# Altium project Gas_Analyzer.PrjPcb
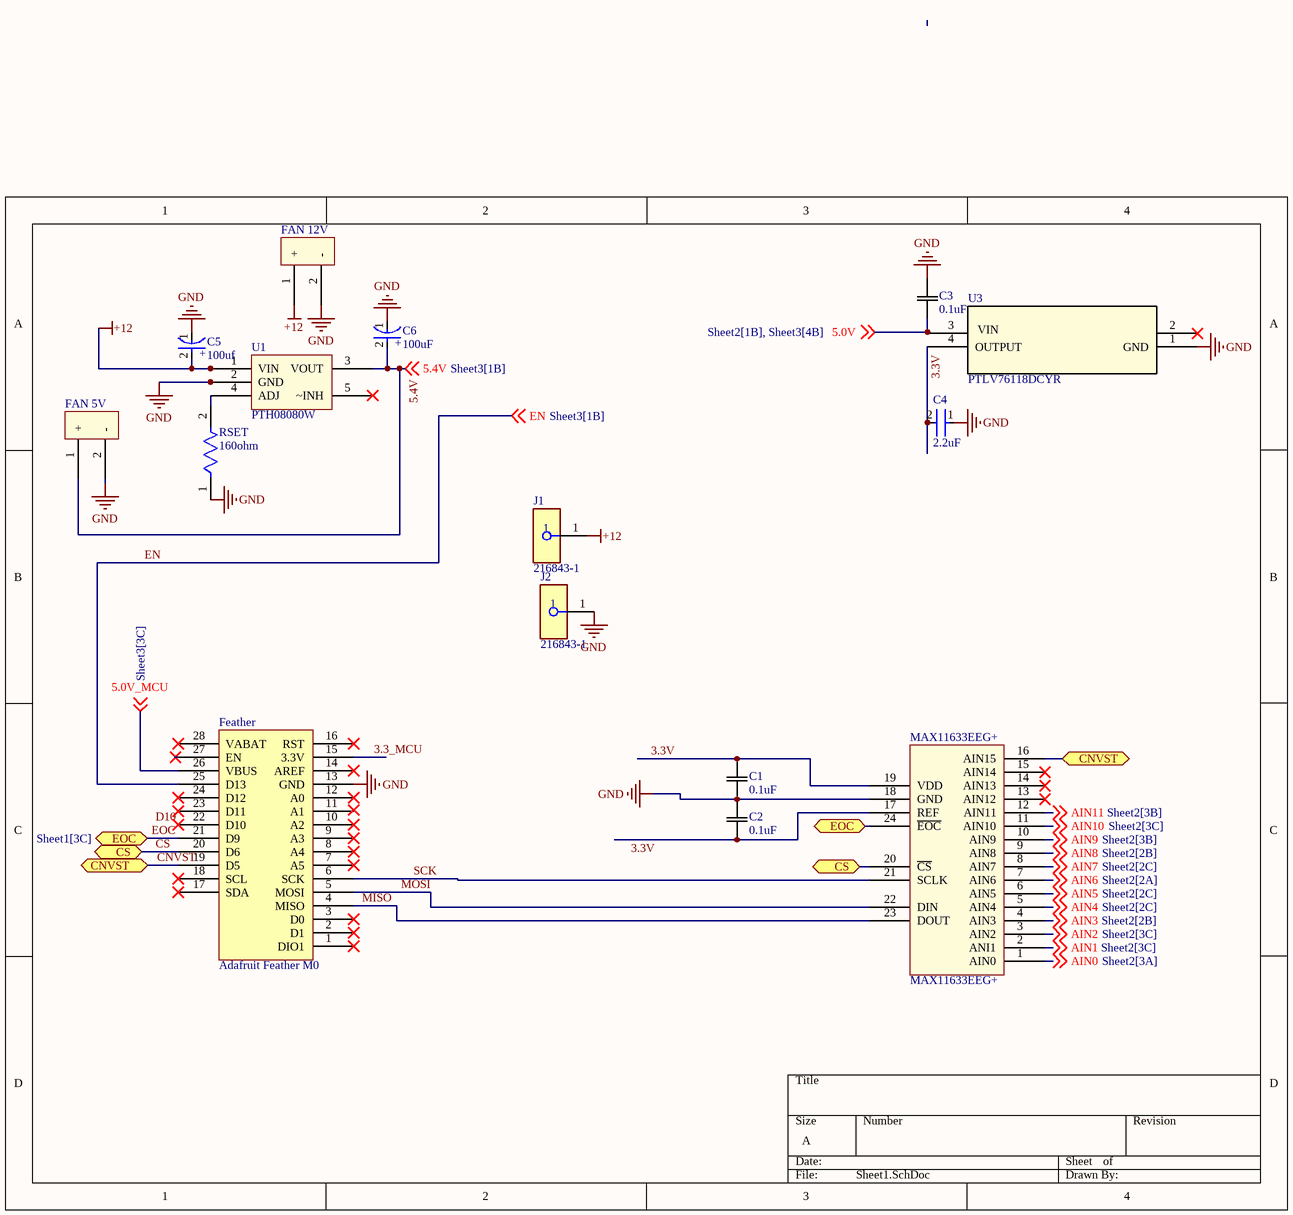
[diagram p0: Sheet1.SchDoc]
3 sheets, 35 parts. Net scope: flat (ports and power ports of the same name join across sheets).
Board file: PCB1.PcbDoc
Sheets:
  Sheet1.SchDoc
  Sheet2.SchDoc
  Sheet3.SchDoc

## Sheet Sheet1.SchDoc
size A; Author: DEVANSH AGRAWAL; CompanyName: WISEST; DrawnBy: DEVANSH; SheetNumber: 1; SheetTotal: 3

### Parts
C1  0.1uF  [CL10B104KB8NNWC]
C2  0.1uF  [CL10B104KB8NNWC]
C3  0.1uF  [CL10B104KB8NNWC]
C4  2.2uF  [FP-CL21F-IPC_C]
C5  100uf  [FP-RAD-TH-D_6_3_0_5-L_11-MFG]
C6  100uF  [FP-RAD-TH-D_6_3_0_5-L_11-MFG]
FAN_5V  (no value)  [Molex 5021]
FAN_12V  (no value)  [Molex 5021]
Feather  Adafruit Feather M0  [MODULE_FEATHER_M0_BASIC_PROTO]  (no BOM)
J1  216843-1  [FP-216843-1-MFG]
J2  216843-1  [FP-216843-1-MFG]
MAX11633EEG+  MAX11633EEG+  [QSOP24]
RSET  160ohm  [FP-CRCW0805-e3-MFG]
U1  PTH08080W  [VREG_PTH08080WAH]
U3  PTLV76118DCYR  [SOT_8DCYR_TEX]

### Ports
CNVST (bidir, see Sheet1[1C]), CNVST (bidir, see Sheet1[4C]), CS (bidir, see Sheet1[1C]), CS (bidir, see Sheet1[3C]), EOC (bidir, see Sheet1[1C]), EOC (bidir, see Sheet1[3C])

### Nets
+12: C5.2(A) FAN_12V.1(+) J1.1 U1.1(VIN)
GND: C1.1 C2.2 C3.2 C4.1 C5.1(C) C6.1(C) FAN_5V.2(-) FAN_12V.2(-) Feather.13(GND) J2.1 MAX11633EEG+.18(GND) RSET.1 U1.2(GND) U3.1(GND)
3.3_MCU: Feather.15(3.3V)
3.3V: C1.2 C2.1 C4.2 MAX11633EEG+.17(REF) MAX11633EEG+.19(VDD) U3.4(OUTPUT)
5.0V: C3.1 U3.3(INPUT) ; off-sheet 5.0V
5.0V_MCU: Feather.26(VBUS) ; off-sheet 5.0V_MCU
5.4V: C6.2(A) FAN_5V.1(+) U1.3(VOUT) ; off-sheet 5.4V
~{C}S: Feather.20(D6) MAX11633EEG+.20(~{CS}) ; port CS
AIN0: MAX11633EEG+.1(AIN0) ; off-sheet AIN0
AIN1: MAX11633EEG+.2(ANI1) ; off-sheet AIN1
AIN2: MAX11633EEG+.3(AIN2) ; off-sheet AIN2
AIN3: MAX11633EEG+.4(AIN3) ; off-sheet AIN3
AIN4: MAX11633EEG+.5(AIN4) ; off-sheet AIN4
AIN5: MAX11633EEG+.6(AIN5) ; off-sheet AIN5
AIN6: MAX11633EEG+.7(AIN6) ; off-sheet AIN6
AIN7: MAX11633EEG+.8(AIN7) ; off-sheet AIN7
AIN8: MAX11633EEG+.9(AIN8) ; off-sheet AIN8
AIN9: MAX11633EEG+.10(AIN9) ; off-sheet AIN9
AIN10: MAX11633EEG+.11(AIN10) ; off-sheet AIN10
AIN11: MAX11633EEG+.12(AIN11) ; off-sheet AIN11
CNVST: Feather.19(D5) MAX11633EEG+.16(AIN15) ; port CNVST
EN: Feather.25(D13) ; off-sheet EN
EOC: Feather.21(D9) MAX11633EEG+.24(~{EOC}) ; port EOC
MISO: Feather.4(MISO) MAX11633EEG+.23(DOUT)
MOSI: Feather.5(MOSI) MAX11633EEG+.22(DIN)
SCK: Feather.6(SCK) MAX11633EEG+.21(SCLK)
NetRSET_2: RSET.2 U1.4(ADJ)

Not connected (* = marked no-connect by the designer): Feather 1(DIO1)* 2(D1)* 3(D0)* 7(A5)* 8(A4)* 9(A3)* 10(A2)* 11(A1) 12(A0)* 14(AREF)* 16(RST)* 17(SDA)* 18(SCL)* 22(D10)* 23(D11)* 24(D12)* 27(EN)* 28(VABAT)*; MAX11633EEG+ 13(AIN12)* 14(AIN13)* 15(AIN14)*; U1 5(~INH)*; U3 2(OUTPUT)*

### Notes on the sheet
- (near U3) VIN
- Labels drawn without touching a wire or pin: 5.4V, D10
- (in symbol CMP-05427-000856-1) +

### Library data of the parts
C1-C3 = CL10B104KB8NNWC: No Description Available; Mfr_Name: Samsung; Type: DEV; Copyright: Copyright (C) 2023 Ultra Librarian. All rights reserved.; Manufacturer_Part_Number: CL10B104KB8NNWC; RefDes: RefDes
C4 = CMP-13271-000021-1: CAP CER 2.2UF 16V X7R 0805; Manufacturer: Samsung Electro-Mechanics America, Inc; Manufacturer Part Number: CL21B225KOFNNNE; Temperature Coefficient: 15%; Material: Ceramic; Tolerance: 10%; Height: 1.35mm; Device Class L2: Capacitors; Automotive: No; Digikey Description: CAP CER 2.2UF 16V X7R 0805; Octopart: https://octopart.com/cl21b225kofnnne-samsung-11855629; Temperature Characteristic: X7R; RoHS: TRUE; Temperature Range High: +125°C; ComponentLink2URL: http://www.samsungsem.com/global/support/product-search/index.jsp; Temperature: -55°C to +125°C; Lead Free: Yes; Ipc Land Pattern Name: CAPC200125X125; Category: Cap; Value: 2.2uF; Device Class L1: Passive Components; Temperature Range Low: -55°C; Package: CL21F; Device Class L3: Ceramic Capacitors; Voltage Rating: 16V; Capacitance: 2.2uF; ComponentLink2Description: Datasheet
C5 C6 = CMP-05427-000856-1: Aluminum Electrolytic Capacitors (Radial Lead Type) 100uF ±20% 25V; Lead Diameter: 0.5mm; Polarity: Polar; Ripple Current: 455mA; Impedance: 130mR; Life (Hours): 2000Hour; Length: 11mm; Min Operating Temperature: -40°C; Termination: Radial; Diameter: 6mm; Lead Pitch: 5mm; Tolerance: 20%; Capacitance: 100uF; Case/Package: Radial; Voltage Rating (DC): 25V; Height - Seated (Max): 0.5inch; RoHS Compliant: Yes; Series: FM; Package Quantity: 2000; Voltage Rating: 25V; Max Operating Temperature: 105°C; Mount: Through Hole; ESR (Equivalent Series Resistance): 130mR; Packaging: Tape and Reel
FAN_5V FAN_12V = MOLEX 5021
J1 J2 = CMP-03369-000001-1: CONN QC TAB 0.250 PRESS-FIT; Manufacturer: TE; Is Female: yes; Number Of Contacts: 1; Conn Orientation: Straight; Conn Gender: Female; Description: Terminals .250 POS LOCK TAB; Height: 13.5mm; Digikey Description: CONN QC TAB 0.250 PRESS-FIT; Device Class L2: Headers and Wire Housings; Temperature Range High: +110°C; Temperature Range Low: -30°C; ComponentLink2Description: Datasheet; Package: 216843-1; Device Class L1: Connectors; Category: Conn; Footprint Url: https://www.te.com/commerce/DocumentDelivery/DDEController?Action=showdoc&DocId=Customer+Drawing%7F216843%7FB1%7Fpdf%7FGerman%7FGER_CD_216843_B1.pdf%7F216843-1; Mouser Description: Terminals .250 POS LOCK TAB; ComponentLink2URL: https://www.te.com/usa-en/product-216843-1.html?te_bu=Cor&te_type=other&te_campaign=oct_glo_cor-oct-global-oth-prtnr-fy19-oct-octo-buy-bom_sma-298_2&elqCampaignId=35216; Octopart: https://octopart.com/216843-1-te+connectivity-46512127; Contact Material: Tin; Device Class L3: unset; Temperature: -30°C to +110°C; Automotive: No; Lead Free: Yes; Manufacturer Part Number: 216843-1
RSET = CMP-2001-03804-2: RES Thick Film, 30kΩ, 1%, 0.125W, 100ppm/°C, 0805; Max Power Dissipation: 125mW; Voltage Rating (DC): 150V; Resistance: 30kR; Contact Plating: Tin; Weight: 0.000194oz; Temperature Coefficient: 100ppm/°C; Packaging: Tape and Reel; Height: 0.45mm; Case Code (Imperial): 0805; Max Operating Temperature: 155°C; Case/Package: 0805; Package Quantity: 10; Case Code (Metric): 2012; Features: Automotive AEC-Q200; Mount: Surface Mount; Length: 2mm; Termination: SMD/SMT; Lead Free: Lead Free; Width: 0.049inch; Number of Pins: 2; Depth: 1.25mm; Min Operating Temperature: -55°C; Power Rating: 125mW; Voltage Rating: 150V; Military Standard: Not; Composition: Thick Film; Tolerance: 1%; Number of Terminations: 2; Radiation Hardening: No
U3 = PTLV76118DCYR: No Description Available; Mfr_Name: Texas Instruments; Copyright: Copyright (C) 2023 Ultra Librarian. All rights reserved.; Manufacturer_Part_Number: PTLV76118DCYR; RefDes: RefDes; Type: DEV

## Sheet Sheet2.SchDoc
size A; DrawnBy: Devansh; SheetNumber: 2; SheetTotal: 3
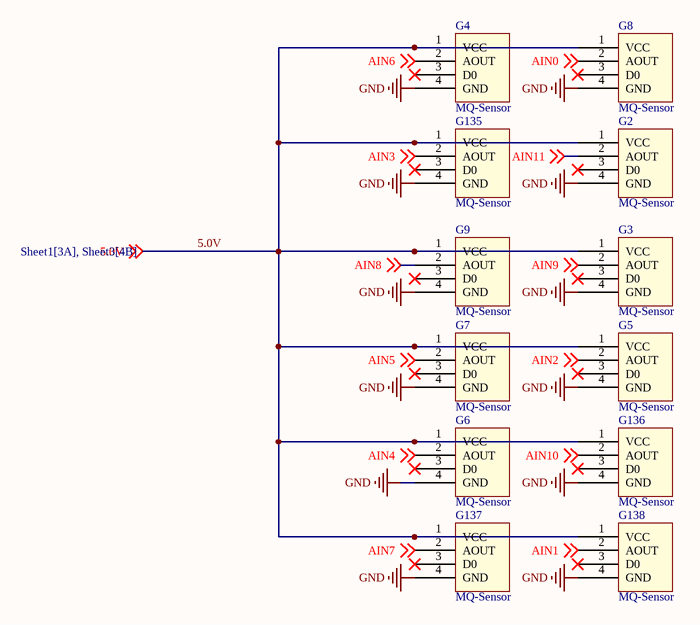
[diagram p1: Sheet2.SchDoc]

### Parts
G2  MQ-Sensor  [MQ-FOOTPRINT-B]
G3  MQ-Sensor  [MQ-FOOTPRINT-B]
G4  MQ-Sensor  [MQ-FOOTPRINT-B]
G5  MQ-Sensor  [MQ-FOOTPRINT-B]
G6  MQ-Sensor  [MQ-FOOTPRINT-B]
G7  MQ-Sensor  [MQ-FOOTPRINT-B]
G8  MQ-Sensor  [MQ-FOOTPRINT-B]
G9  MQ-Sensor  [MQ-FOOTPRINT-B]
G135  MQ-Sensor  [MQ-FOOTPRINT-B]
G136  MQ-Sensor  [MQ-Footprint-A]
G137  MQ-Sensor  [MQ-Footprint-A]
G138  MQ-Sensor  [MQ-FOOTPRINT-C]

### Nets
GND: G2.4(GND) G3.4(GND) G4.4(GND) G5.4(GND) G6.4(GND) G7.4(GND) G8.4(GND) G9.4(GND) G135.4(GND) G136.4(GND) G137.4(GND) G138.4(GND)
5.0V: G2.1(VCC) G3.1(VCC) G4.1(VCC) G5.1(VCC) G6.1(VCC) G7.1(VCC) G8.1(VCC) G9.1(VCC) G135.1(VCC) G136.1(VCC) G137.1(VCC) G138.1(VCC) ; off-sheet 5.0V
AIN0: G8.2(AOUT) ; off-sheet AIN0
AIN1: G138.2(AOUT) ; off-sheet AIN1
AIN2: G5.2(AOUT) ; off-sheet AIN2
AIN3: G135.2(AOUT) ; off-sheet AIN3
AIN4: G6.2(AOUT) ; off-sheet AIN4
AIN5: G7.2(AOUT) ; off-sheet AIN5
AIN6: G4.2(AOUT) ; off-sheet AIN6
AIN7: G137.2(AOUT) ; off-sheet AIN7
AIN8: G9.2(AOUT) ; off-sheet AIN8
AIN9: G3.2(AOUT) ; off-sheet AIN9
AIN10: G136.2(AOUT) ; off-sheet AIN10
AIN11: G2.2(AOUT) ; off-sheet AIN11

Not connected (* = marked no-connect by the designer): G2 3(D0)*; G3 3(D0)*; G4 3(D0)*; G5 3(D0)*; G6 3(D0)*; G7 3(D0)*; G8 3(D0)*; G9 3(D0)*; G135 3(D0)*; G136 3(D0)*; G137 3(D0)*; G138 3(D0)*

## Sheet Sheet3.SchDoc
size A; SheetNumber: 3; SheetTotal: 3
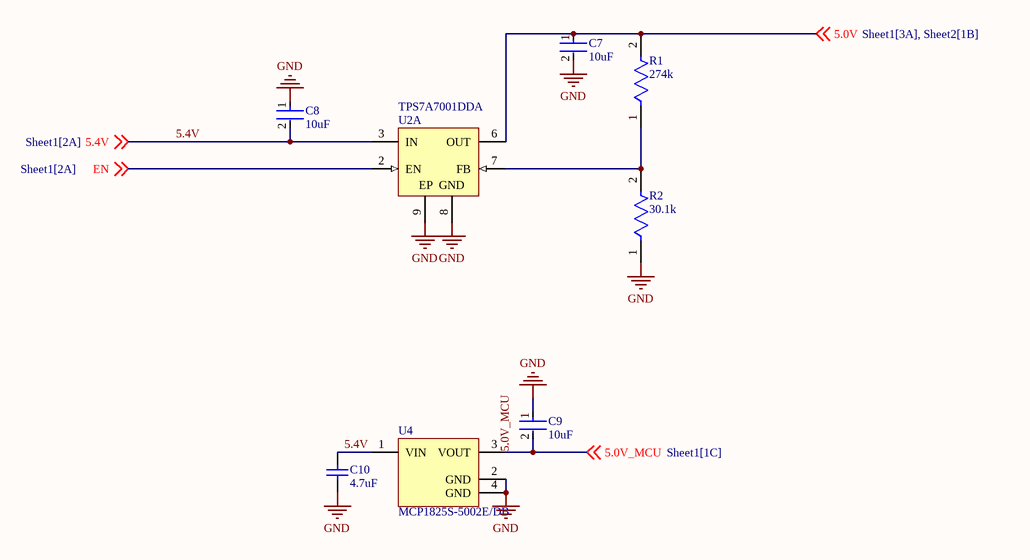
[diagram p2: Sheet3.SchDoc]

### Parts
C7  10uF  [FP-GRM21B-0_1-IPC_C]
C8  10uF  [FP-GRM21B-0_1-IPC_C]
C9  10uF  [FP-GRM21B-0_1-IPC_C]
C10  4.7uF  [CAPC2013X135X45LL10T25]
R1  274k  [FP-CRCW0805-e3-MFG]
R2  30.1k  [FP-CRCW0805-e3-MFG]
U2  TPS7A7001DDA  [DDA0008E_M]  (part A of 2)
U4  MCP1825S-5002E/DB  [SOT-223-DB3_N]

### Nets
GND: C7.2 C8.1 C9.1 C10.1 R2.1 U2.8(GND) U2.9(EP) U4.2(GND) U4.4(GND)
5.0V: C7.1 R1.2 U2.6(OUT) ; off-sheet 5.0V
5.0V_MCU: C9.2 U4.3(VOUT) ; off-sheet 5.0V_MCU
5.4V: C8.2 C10.2 U2.3(IN) U4.1(VIN) ; off-sheet 5.4V
EN: U2.2(EN) ; off-sheet EN
NetR1_1: R1.1 R2.2 U2.7(FB)

### Library data of the parts
C7-C9 = CMP-2007-03453-2: Chip Multilayer Ceramic Capacitors for General Purpose, 0805, 10uF, X5R, 15%, 10%, 16V; Radiation Hardening: No; Thickness: 0.053inch; Voltage Rating (DC): 16V; Lead Free: Lead Free; Package Quantity: 1; Width: 1.25mm; Case Code (Imperial): 0805; Depth: 1.25mm; Packaging: Tape and Reel; Dielectric: X5R; Max Operating Temperature: 85°C; Tolerance: 10%; Voltage Rating: 16V; Voltage: 16V; Capacitance: 10uF; Height: 1.25mm; Case Code (Metric): 2012; Material: Ceramic; Mount: Surface Mount; Case/Package: 0805; REACH SVHC: No SVHC; Length: 2mm; Min Operating Temperature: -55°C; Termination: SMD/SMT
C10 = CMP-1662-00015-2: Chip Capacitor, 4.7 uF, +/- 10%, 16 V, -55 to 85 degC, 0805 (2012 Metric), RoHS, Tape and Reel; PartNumber: GRM21BR61C475KA88L; Voltage Rating (DC): 16 V; Type (Capacitors): X5R; Case\/Package: 0805; Pins: 2; DatasheetVersion: 03/2016; REACH SVHC: No SVHC; Tolerance: 10%; Width: 1.25 mm; Capacitance: 4.7 uF; Mount: Surface Mount; ComponentLink1Description: Manufacturer URL; Case Code (Metric): 2012; PackageDescription: 2-Pin Surface Mount Device, Body 2 x 1.25 mm; Height: 1.25 mm; Voltage Rating: 16 V; Max Operating Temperature: 85 degC; RoHSCompliant: true; Length: 2 mm; ComponentLink1URL: http://www.murata.com/; Mounting Technology: Surface Mount; Packaging: Tape and Reel; Min Operating Temperature: -55 degC; ComponentLink2Description: Datasheet; Case Code (Imperial): 0805; Radiation Hardening: No; Package Quantity: 3000; PackageReference: 0805; ComponentLink2URL: http://search.murata.co.jp/Ceramy/image/img/A01X/G101/ENG/GRM21BR61C475KA88-01.pdf
R1 = CMP-2001-03738-2: RES Thick Film, 274kΩ, 1%, 0.125W, 100ppm/°C, 0805; Resistance: 274kR; Max Power Dissipation: 125mW; Voltage Rating: 150V; Height: 0.45mm; Lead Free: Lead Free; Width: 0.049inch; Case Code (Metric): 2012; Military Standard: Not; Packaging: Tape and Reel; Min Operating Temperature: -55°C; Termination: SMD/SMT; Contact Plating: Tin; Composition: Thick Film; Features: Automotive AEC-Q200; Radiation Hardening: No; Power Rating: 125mW; Temperature Coefficient: 100ppm/°C; Package Quantity: 10; Length: 2mm; Max Operating Temperature: 155°C; Voltage Rating (DC): 150V; Tolerance: 1%; Number of Terminations: 2; Case/Package: 0805; Case Code (Imperial): 0805; Number of Pins: 2; Depth: 1.25mm; Weight: 0.000194oz
R2 = CMP-2001-03804-2: as RSET on sheet Sheet1; Contact Plating: Tin; Weight: 0.000194oz; Temperature Coefficient: 100ppm/°C; Packaging: Tape and Reel; Height: 0.45mm; Case Code (Imperial): 0805; Max Operating Temperature: 155°C; Case/Package: 0805; Package Quantity: 10; Case Code (Metric): 2012; Features: Automotive AEC-Q200; Mount: Surface Mount; Length: 2mm; Termination: SMD/SMT; Lead Free: Lead Free; Width: 0.049inch; Number of Pins: 2; Depth: 1.25mm; Min Operating Temperature: -55°C; Power Rating: 125mW; Voltage Rating: 150V; Military Standard: Not; Composition: Thick Film; Tolerance: 1%; Number of Terminations: 2; Radiation Hardening: No
U2 = CMP-0395-00551-2: Single Output Very Low Input LDO, 2 A, Adjustable 0.9 to 5 V Output, 1.5 to 6.5 V Input, 8-pin SOPowerPAD (DDA), -40 to 125 degC, Green (RoHS & no Sb/Br); Manufacturer: Texas Instruments; Iout(Max)(A): 2; Vin(Min)(V): 1.5; Vout Adj(Min)(V): 0.9; Iq(Typ)(mA): 0.01; Vdo(Typ)(mV): 170; Vin(Max)(V): 6.5; Vout Adj(Max)(V): 5; SubFamily: Single Channel LDO; PartNumber: TPS7A7001DDA; ComponentLink3URL: http://www.ti.com/litv/pdf/mpds092e; ComponentLink3Description: Package Specification; Accuracy(%): 2; ComponentLink2URL: http://www.ti.com/general/docs/lit/getliterature.tsp?genericPartNumber=TPS7A7001&fileType=pdf; ComponentLink2Description: Datasheet; PackageReference: DDA0008E; PackageDescription: 8-Pin Plastic Small Outline, Body 3.9 x 4.9 mm, Pitch 1.27 mm; ComponentLink1URL: http://www.ti.com/; DatasheetVersion: SBVS134B; PackageVersion: 4202561/F; Mounting Technology: Surface Mount; Code_JEDEC: MS-012; ComponentLink1Description: Manufacturer URL; Eco-Plan: Green (RoHS & no Sb/Br)
U4 = CMP-0136-00456-1: 500 mA, Low Voltage, Low Quiescent Current LDO Regulator, 3-Pin SOT-223, Extended Temperature; DatasheetVersion: revB, Feb-2008; PackageVersion: revBB, Aug-2009; PackageReference: SOT-223-DB3; PackageDescription: 3-Lead Plastic Small Outline Transistor (DB) [SOT-223]

## Nets that join several sheets
GND: Sheet1 (14 pins), Sheet2 (12 pins), Sheet3 (9 pins)
5.0V: Sheet1 (C3.1 U3.3), Sheet2 (12 pins), Sheet3 (C7.1 R1.2 U2.6)
5.0V_MCU: Sheet1 (Feather.26), Sheet3 (C9.2 U4.3)
5.4V: Sheet1 (C6.2 FAN_5V.1 U1.3), Sheet3 (C8.2 C10.2 U2.3 U4.1)
AIN0: Sheet1 (MAX11633EEG+.1), Sheet2 (G8.2)
AIN1: Sheet1 (MAX11633EEG+.2), Sheet2 (G138.2)
AIN2: Sheet1 (MAX11633EEG+.3), Sheet2 (G5.2)
AIN3: Sheet1 (MAX11633EEG+.4), Sheet2 (G135.2)
AIN4: Sheet1 (MAX11633EEG+.5), Sheet2 (G6.2)
AIN5: Sheet1 (MAX11633EEG+.6), Sheet2 (G7.2)
AIN6: Sheet1 (MAX11633EEG+.7), Sheet2 (G4.2)
AIN7: Sheet1 (MAX11633EEG+.8), Sheet2 (G137.2)
AIN8: Sheet1 (MAX11633EEG+.9), Sheet2 (G9.2)
AIN9: Sheet1 (MAX11633EEG+.10), Sheet2 (G3.2)
AIN10: Sheet1 (MAX11633EEG+.11), Sheet2 (G136.2)
AIN11: Sheet1 (MAX11633EEG+.12), Sheet2 (G2.2)
EN: Sheet1 (Feather.25), Sheet3 (U2.2)